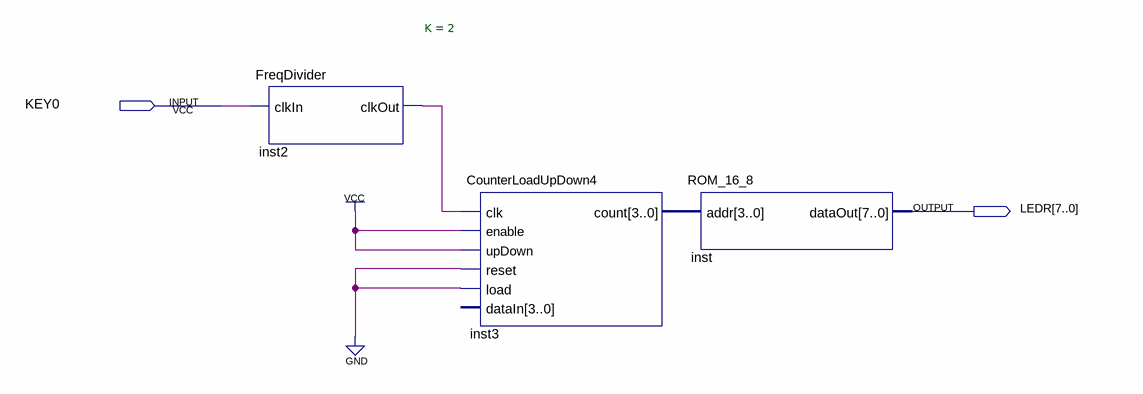
[diagram p0: schematic sheet]
// Quartus schematic ROM_Demo.bdf as structural Verilog: 3 symbols, 2 pins
module ROM_Demo (
  input  KEY0,
  output [7:0] LEDR
);

  wire inst2_clkout;
  wire [3:0] inst3_count;

  FreqDivider #(.K(2)) inst2 (.clkIn(KEY0), .clkOut(inst2_clkout));
  CounterLoadUpDown4 inst3 (
    .clk(inst2_clkout), .enable(1'b1), .upDown(1'b1), .reset(1'b0), .load(1'b0), .count(inst3_count));  // open: dataIn
  ROM_16_8 inst (.addr(inst3_count), .dataOut(LEDR));
endmodule
